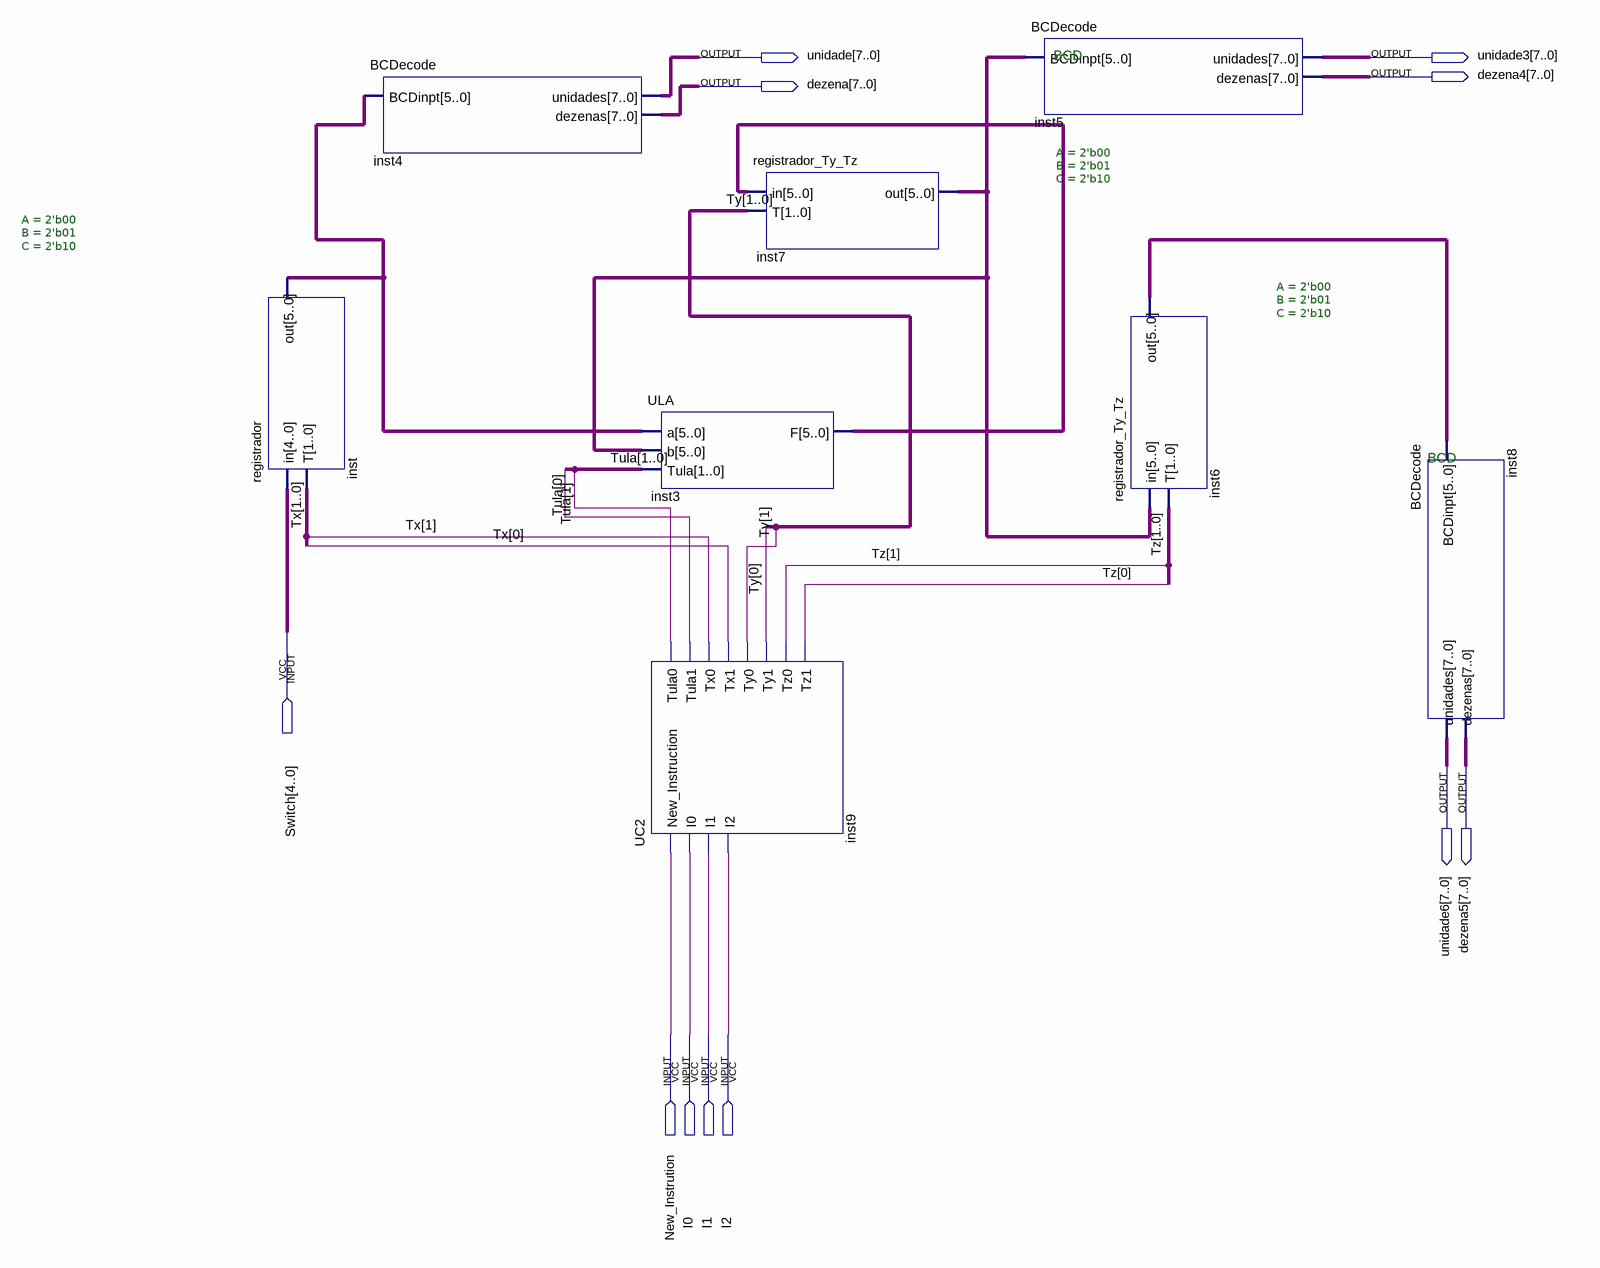
[diagram p0: schematic sheet]
// Quartus schematic Projeto2.bdf as structural Verilog: 8 symbols, 11 pins
module Projeto2 (
  input  [4:0] Switch,
  input  New_Instrution,
  input  I0,
  input  I1,
  input  I2,
  output [7:0] unidade,
  output [7:0] unidade3,
  output [7:0] dezena4,
  output [7:0] dezena,
  output [7:0] unidade6,
  output [7:0] dezena5
);

  wire [1:0] Tula, Tx, Ty, Tz;
  wire [5:0] inst3_f, inst6_out, inst7_out, inst_out;

  registrador #(.A(2'b00), .B(2'b01), .C(2'b10)) inst (.in(Switch), .T(Tx), .out(inst_out));
  BCDecode inst4 (.BCDinpt(inst_out), .unidades(unidade), .dezenas(dezena));
  ULA inst3 (.a(inst_out), .b(inst7_out), .Tula(Tula), .F(inst3_f));
  UC2 inst9 (
    .New_Instruction(New_Instrution), .I0(I0), .I1(I1), .I2(I2), .Tula0(Tula[1]), .Tula1(Tula[0]),
    .Tx0(Tx[1]), .Tx1(Tx[0]), .Ty0(Ty[1]), .Ty1(Ty[0]), .Tz0(Tz[1]), .Tz1(Tz[0]));
  registrador_Ty_Tz #(.A(2'b00), .B(2'b01), .C(2'b10)) inst7 (.in(inst3_f), .T(Ty), .out(inst7_out));
  BCDecode inst5 (.BCDinpt(inst7_out), .unidades(unidade3), .dezenas(dezena4));
  registrador_Ty_Tz #(.A(2'b00), .B(2'b01), .C(2'b10)) inst6 (.in(inst7_out), .T(Tz), .out(inst6_out));
  BCDecode inst8 (.BCDinpt(inst6_out), .unidades(unidade6), .dezenas(dezena5));

  // Notes on the sheet:
  //   BCD
  //   BCD
endmodule
